# EAGLE design nerves_key5 (EAGLE 9.1.0)
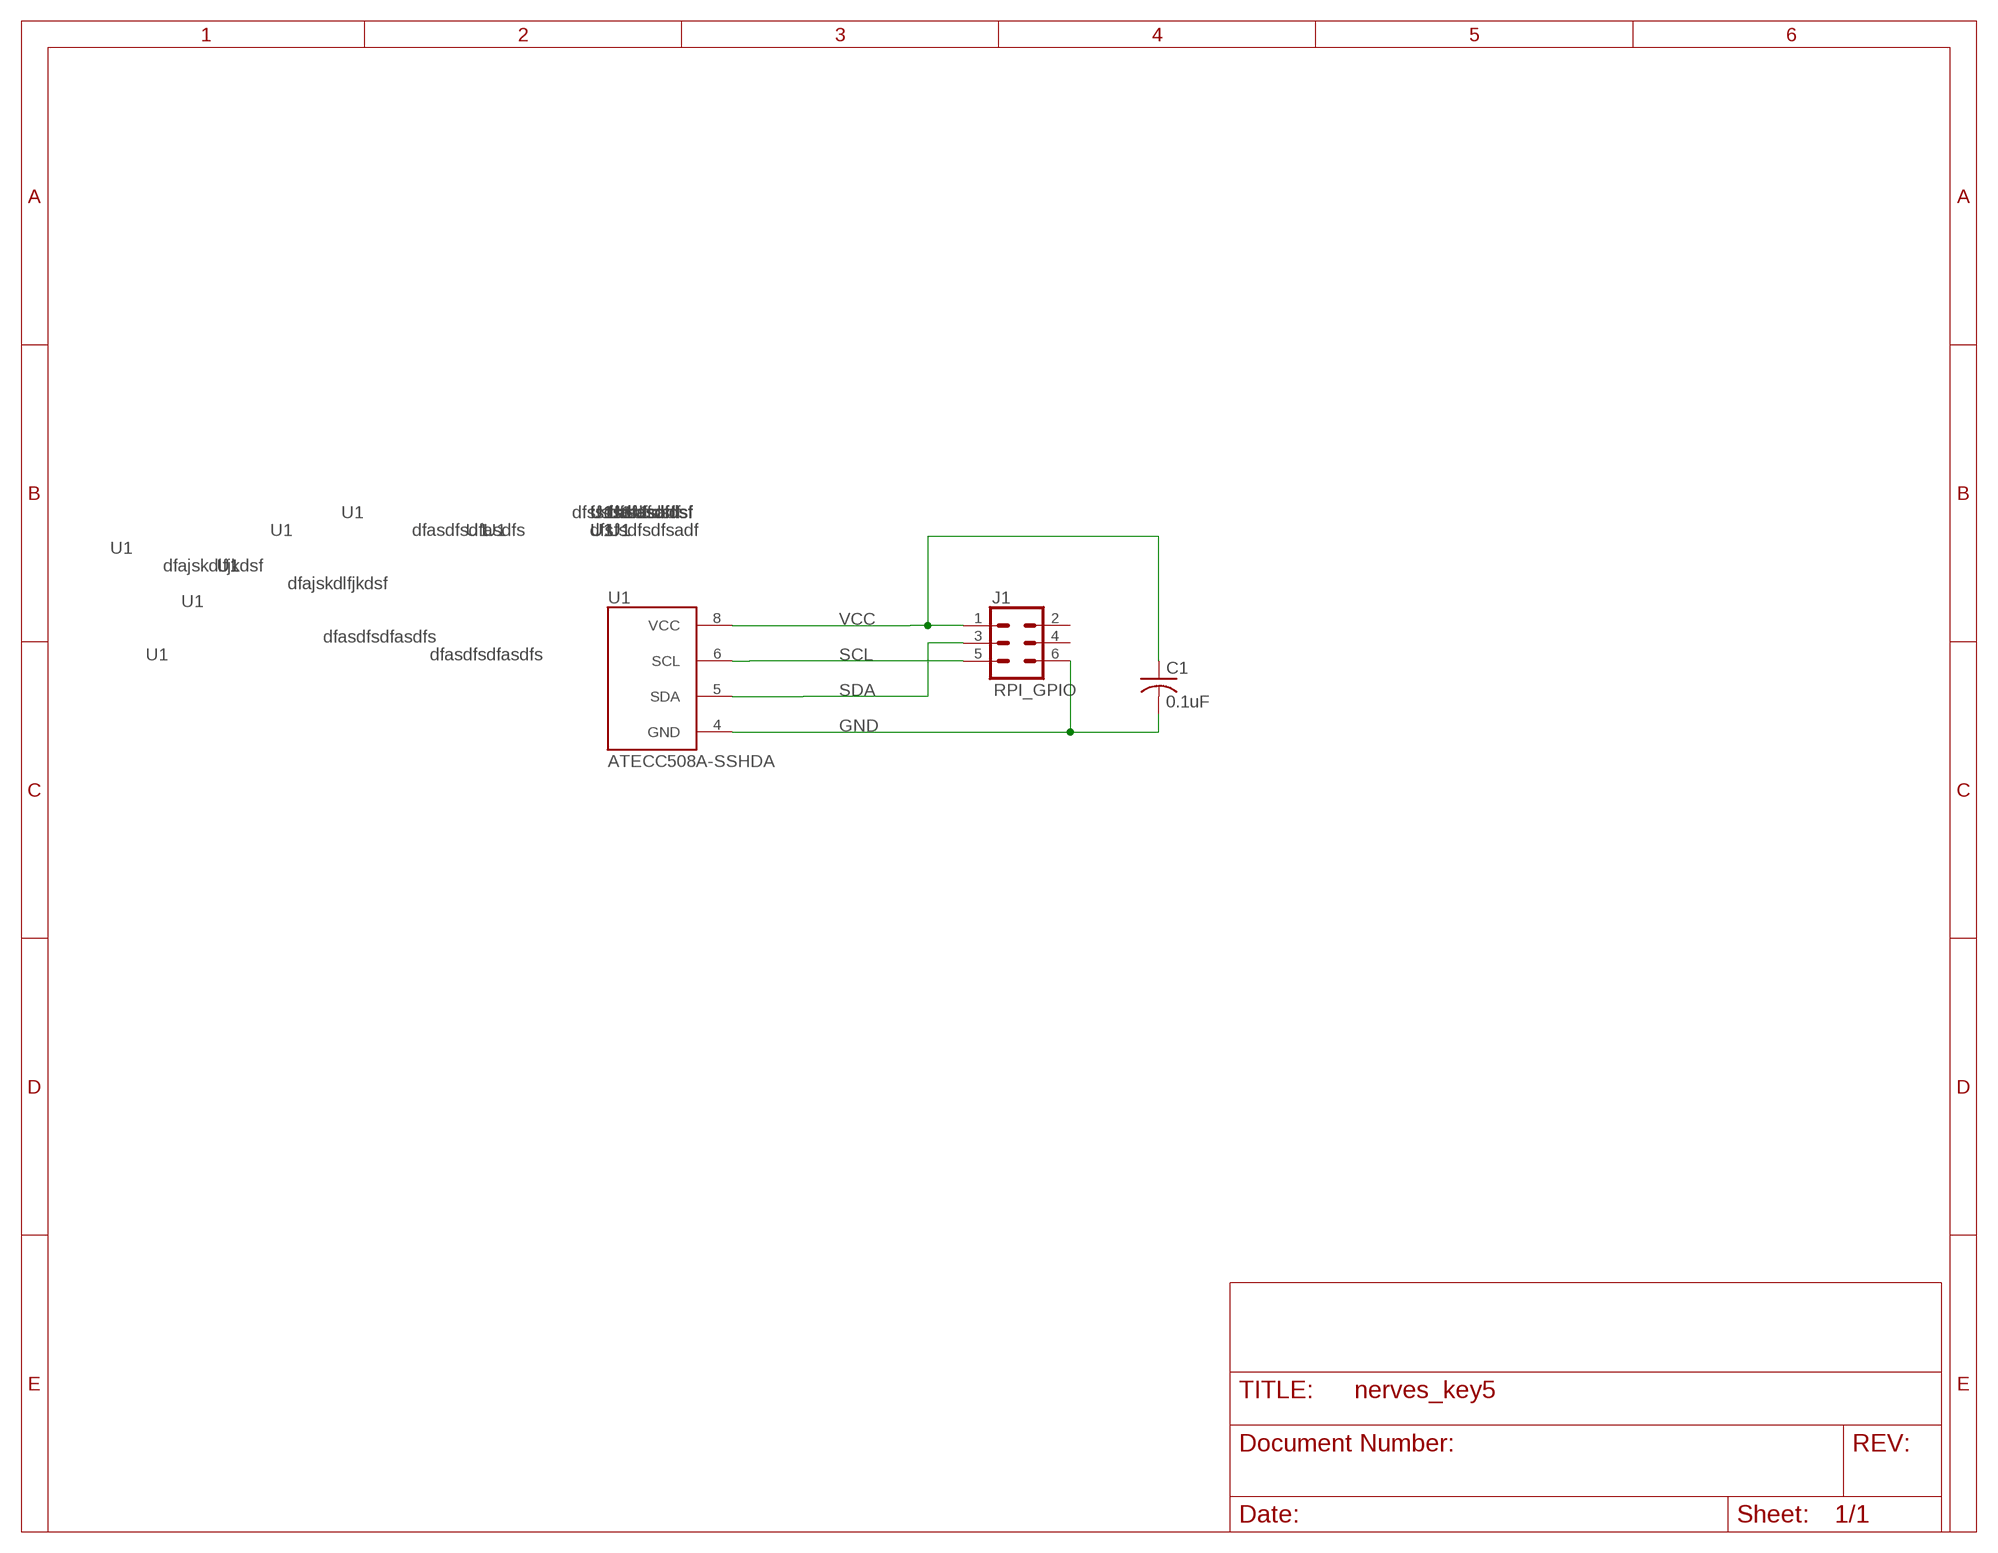
[diagram p0: schematic, sheet 1]

## Parts
C1  0.1uF  C-USC0603  [C0603]
J1  RPI_GPIO  CONN_03X2_TIGHT2X3_BIG_HOLES  [2X3_BIG_HOLES]
U1  ATECC508A-SSHDA  ATECC508ASOIC-8-NARROW  [SOIC127P625X175-8]

## Nets
GND: C1.2 J1.6 U1.4(GND)
SCL: J1.5 U1.6(SCL)
SDA: J1.3 U1.5(SDA)
VCC: C1.1 J1.1 U1.8(VCC)
Unconnected: J1.2 J1.4

## Library data of the parts
C1 = rcl:C-US: CAPACITOR, American symbol; SPICEPREFIX: C
J1 = cryptopi:CONN_03X2_TIGHT: Multi connection point. Often used as Generic Header-pin footprint for 0.1 inch spaced/style header connections You can populate with any combo of single row headers, but if you'd like an exact match, check these: Header - 2x3 (Male, 0.1") <https://www.sparkfun.com/products/12807> (PRT-12807) Header - 2x3 (Female, 0.1") <https://www.sparkfun.com/products/13010> (PRT-13010) 2x3 Pin Shrouded Header <https://www.sparkfun.com/products/10877> (PRT-10877) On any of the 0.1 inch spaced packages, you can populate with these: Break Away Headers - Straight <https://www.sparkfun.com/products/116> (PRT-00116) Break Away Male Headers - Right Angle <https://www.sparkfun.com/products/553> (PRT-00553) Female Headers <https://www.sparkfun.com/products/115> (PRT-00115) Break Away Headers - Machine Pin <https://www.sparkfun.com/products/117> (PRT-00117) Break Away Female Headers - Swiss Machine Pin <https://www.sparkfun.com/products/743> (PRT-00743) Special note: the shrouded connector mates well with our 3x2 ribbon cables: Ribbon Crimp Connector - 6-pin (2x3, Female) <https://www.sparkfun.com/products/10651> (PRT-10651) Ribbon Cable - 6 wire (15ft) <https://www.sparkfun.com/products/10646> (PRT-10646)
U1 = cryptopi:ATECC508A

## Board
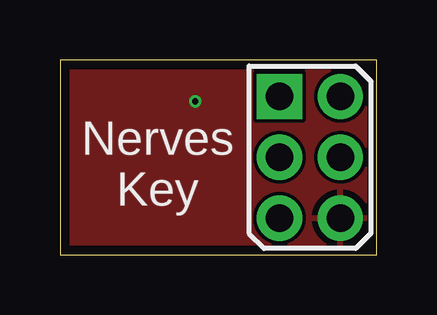
[diagram p1: board, top side]
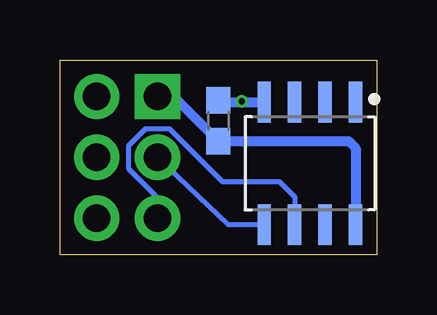
[diagram p2: board, bottom side, seen from below]

Size 13.21 x 8.13 mm. Coordinates in mm from the lower left corner, seen from the top.
Outline: 0,0 13.21,0 13.21,8.13 0,8.13 0,0
Copper layers (1*16): Top 0.035559375mm / dielectric 1.6mm / Bottom 0.035559375mm
Design rules "oshpark-2layer *": minimum track width 6mil, minimum drill 10mil, track to track 6mil, track to pad 6mil, pad to pad 6mil, via to via 6mil, smd to smd 6mil, copper to edge 15mil, drill to drill 6mil, minimum pad ring 5mil, minimum via ring 5mil, stop-mask expansion 2.5mil, vias tented up to drill 15mil, thermal gap 10mil

### Footprints (pad centres in the part's own frame; a part is rotated, then mirrored left to right if it is on the bottom)
C0603 = smd 1.1 x 1: 1 -0.85,0; 2 0.85,0
2X3_BIG_HOLES = drill 1.143 pad 1.88 square: 1 0,0 | drill 1.143 pad 1.88: 2 0,2.54; 3 2.54,0; 4 2.54,2.54; 5 5.08,0; 6 5.08,2.54
SOIC127P625X175-8 = smd 1.7 x 0.559: 1 -2.556,1.905; 2 -2.556,0.635; 3 -2.556,-0.635; 4 -2.556,-1.905; 5 2.556,-1.905; 6 2.556,-0.635; 7 2.556,0.635; 8 2.556,1.905

### Placement (x,y rotation side)
C1  6.6,5.59 90 bottom
J1  9.14,6.6 270 top
U1  2.79,3.81 270 bottom

### Tracks (layer width: path | path; a pad name or v marks a point on that pad's centre or on a via)
GND  (via drill 0.25)
  Bottom 0.152: v5.64,6.4 5.64,6.37
  Bottom 0.406: C1.2 6.53,6.37 5.64,6.37 U1.4
  pour Top: 0,8.13 13.21,8.13 13.21,0 0,0
SCL
  Bottom 0.203: J1.5 9.14,2.38 10.34,3.57 10.34,4.56 9.64,5.26 8.65,5.26 6.44,3.05 4.06,3.05 3.43,2.41 U1.6
SDA
  Bottom 0.203: J1.3 6.21,1.25 U1.5
VCC
  Bottom 0.406: J1.1 8.47,6.6 C1.1 1.18,4.74 0.89,4.45 U1.8

### Text on the board
tNames: Nerves / Key